# Altium schematic sheet 0603WAF1200T5E1_0603WAF1200T5E.schdoc
size 127 x 99 mm
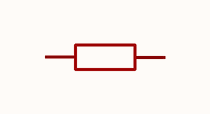
[diagram p0: 0603WAF1200T5E1_0603WAF1200T5E.schdoc]

## Parts
R?  120Ω  [R0603]  (value not drawn)

## Nets

Not connected (* = marked no-connect by the designer): R? 1 2

## Library data of the parts
R? = 0603WAF1200T5E: Manufacturer: UNI-ROYAL(厚声); Add into BOM: yes; Tolerance: ±1%; Power(Watts): 100mW; Overload Voltage (Max): 75V; Temperature Coefficient: ±100ppm/℃; Symbol: 0603WAF1200T5E; Device: 0603WAF1200T5E; LCSC Part Name: 120Ω ±1% 100mW 厚膜电阻; Supplier Part: C22787; Manufacturer Part: 0603WAF1200T5E; Supplier Footprint: 0603; JLCPCB Part Class: Basic Part; Datasheet: https://atta.szlcsc.com/upload/public/pdf/source/20200306/C422600_1E6D84923E4A46A82E41ADD87F860B5C.pdf; Supplier: LCSC; Convert to PCB: yes; Type: 厚膜电阻; Value: 120Ω; Operating Temperature Range: -55℃~+155℃